# EAGLE design participante (EAGLE 7.3.0)

## Sheet 1 of 3
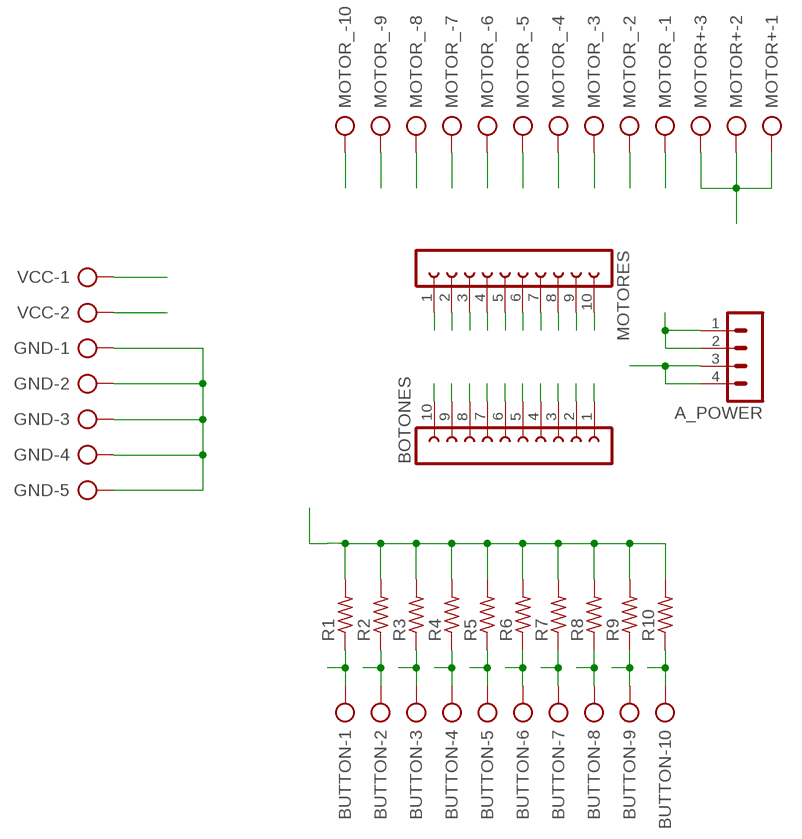
[diagram p0: schematic, sheet 1]

### Parts
A_POWER  MA04-1  [MA04-1]
BOTONES  FE10-1  [FE10]
BUTTON  AK300/10  [AK300/10]
GND  AK300/5  [AK300/5]
MOTOR+  AK300/3  [AK300/3]
MOTOR_  AK300/10  [AK300/10]
MOTORES  FE10-1  [FE10]
R1  R-US_0204/7  [0204/7]
R2  R-US_0204/7  [0204/7]
R3  R-US_0204/7  [0204/7]
R4  R-US_0204/7  [0204/7]
R5  R-US_0204/7  [0204/7]
R6  R-US_0204/7  [0204/7]
R7  R-US_0204/7  [0204/7]
R8  R-US_0204/7  [0204/7]
R9  R-US_0204/7  [0204/7]
R10  R-US_0204/7  [0204/7]
VCC  AK300/2  [AK300/2]

### Nets
5VDC: R1.2 R2.2 R3.2 R4.2 R5.2 R6.2 R7.2 R8.2 R9.2 R10.2 ; also sheet 3
A22: BOTONES.1 BUTTON.1 R1.1
A23: BOTONES.2 BUTTON.2 R2.1
A24: BOTONES.3 BUTTON.3 R3.1
A25: BOTONES.4 BUTTON.4 R4.1
A26: BOTONES.5 BUTTON.5 R5.1
A27: BOTONES.6 BUTTON.6 R6.1
A28: BOTONES.7 BUTTON.7 R7.1
A29: BOTONES.8 BUTTON.8 R8.1
A30: BOTONES.9 BUTTON.9 R9.1
A31: BOTONES.10 BUTTON.10 R10.1
AM_1: MOTORES.1 ; also sheet 2
AM_2: MOTORES.2 ; also sheet 2
AM_3: MOTORES.3 ; also sheet 2
AM_4: MOTORES.4 ; also sheet 2
AM_5: MOTORES.5 ; also sheet 2
AM_6: MOTORES.6 ; also sheet 2
AM_7: MOTORES.7 ; also sheet 2
AM_8: MOTORES.8 ; also sheet 2
AM_9: MOTORES.9 ; also sheet 2
AM_10: MOTORES.10 ; also sheet 2
GND: A_POWER.1 A_POWER.2 GND.1 GND.2 GND.3 GND.4 GND.5 ; also sheet 2,3
M_N1: MOTOR_.1 ; also sheet 2
M_N2: MOTOR_.2 ; also sheet 2
M_N3: MOTOR_.3 ; also sheet 2
M_N4: MOTOR_.4 ; also sheet 2
M_N5: MOTOR_.5 ; also sheet 2
M_N6: MOTOR_.6 ; also sheet 2
M_N7: MOTOR_.7 ; also sheet 2
M_N8: MOTOR_.8 ; also sheet 2
M_N9: MOTOR_.9 ; also sheet 2
M_N10: MOTOR_.10 ; also sheet 2
VCC: MOTOR+.1 MOTOR+.2 MOTOR+.3 VCC.2 ; also sheet 3
VCC_A: A_POWER.3 A_POWER.4 VCC.1

## Sheet 2 of 3
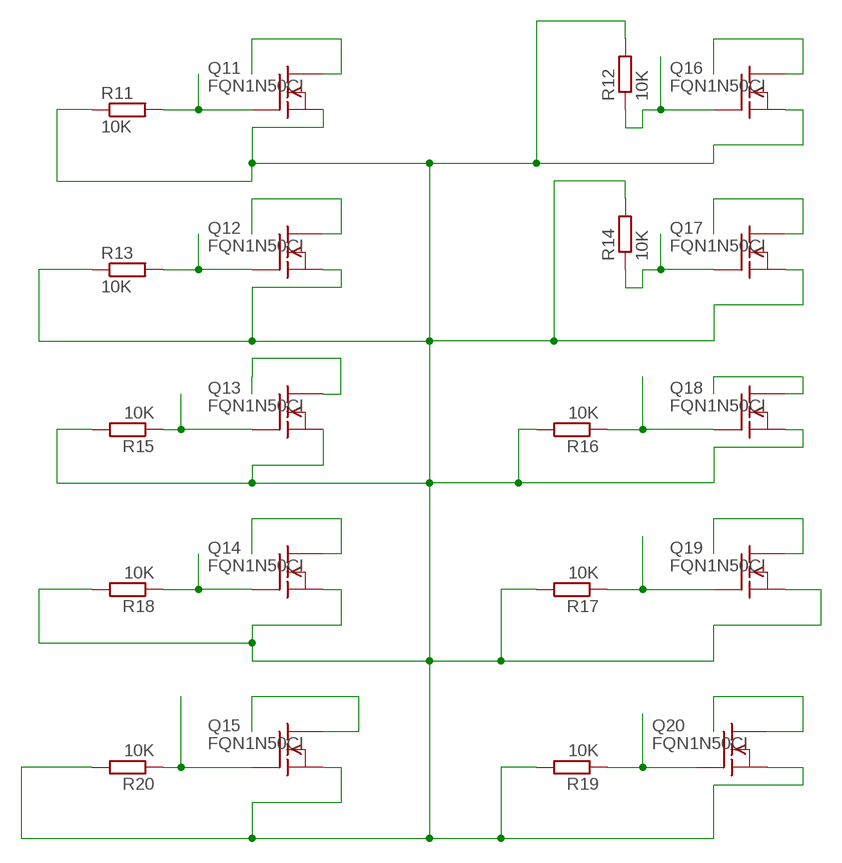
[diagram p1: schematic, sheet 2]

### Parts
Q11  FQN1N50CI  [TO92-INLINE]
Q12  FQN1N50CI  [TO92-INLINE]
Q13  FQN1N50CI  [TO92-INLINE]
Q14  FQN1N50CI  [TO92-INLINE]
Q15  FQN1N50CI  [TO92-INLINE]
Q16  FQN1N50CI  [TO92-INLINE]
Q17  FQN1N50CI  [TO92-INLINE]
Q18  FQN1N50CI  [TO92-INLINE]
Q19  FQN1N50CI  [TO92-INLINE]
Q20  FQN1N50CI  [TO92-INLINE]
R11  10K  R-EU_0207/10  [0207/10]
R12  10K  R-EU_0207/10  [0207/10]
R13  10K  R-EU_0207/10  [0207/10]
R14  10K  R-EU_0207/10  [0207/10]
R15  10K  R-EU_0207/10  [0207/10]
R16  10K  R-EU_0207/10  [0207/10]
R17  10K  R-EU_0207/10  [0207/10]
R18  10K  R-EU_0207/10  [0207/10]
R19  10K  R-EU_0207/10  [0207/10]
R20  10K  R-EU_0207/10  [0207/10]

### Nets
AM_1: Q11.2(G) R11.2 ; also sheet 1
AM_2: Q12.2(G) R13.2 ; also sheet 1
AM_3: Q13.2(G) R15.1 ; also sheet 1
AM_4: Q14.2(G) R18.1 ; also sheet 1
AM_5: Q15.2(G) R20.1 ; also sheet 1
AM_6: Q20.2(G) R19.1 ; also sheet 1
AM_7: Q19.2(G) R17.1 ; also sheet 1
AM_8: Q18.2(G) R16.1 ; also sheet 1
AM_9: Q17.2(G) R14.1 ; also sheet 1
AM_10: Q16.2(G) R12.1 ; also sheet 1
GND: Q11.3(S) Q12.3(S) Q13.3(S) Q14.3(S) Q15.3(S) Q16.3(S) Q17.3(S) Q18.3(S) Q19.3(S) Q20.3(S) R11.1 R12.2 R13.1 R14.2 R15.2 R16.2 R17.2 R18.2 R19.2 R20.2 ; also sheet 1,3
M_N1: Q11.1(D) ; also sheet 1
M_N2: Q12.1(D) ; also sheet 1
M_N3: Q13.1(D) ; also sheet 1
M_N4: Q14.1(D) ; also sheet 1
M_N5: Q15.1(D) ; also sheet 1
M_N6: Q16.1(D) ; also sheet 1
M_N7: Q17.1(D) ; also sheet 1
M_N8: Q18.1(D) ; also sheet 1
M_N9: Q19.1(D) ; also sheet 1
M_N10: Q20.1(D) ; also sheet 1

## Sheet 3 of 3
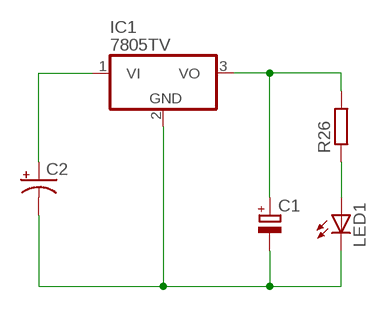
[diagram p2: schematic, sheet 3]

### Parts
C1  CPOL-EUE2.5-6  [E2,5-6]
C2  CPOL-USE3.5-8  [E3,5-8]
IC1  7805TV  [TO220V]
LED1  LED5MM  [LED5MM]
R26  R-EU_0207/10  [0207/10]

### Nets
5VDC: C1.+ IC1.3(VO) R26.2 ; also sheet 1
GND: C1.- C2.- IC1.2(GND) LED1.K(C) ; also sheet 1,2
N$192: LED1.A R26.1
VCC: C2.+ IC1.1(VI) ; also sheet 1

## Library data of the parts
A_POWER = con-lstb:MA04-1: PIN HEADER; OC_FARNELL: unknown; OC_NEWARK: unknown
BOTONES MOTORES = con-lsta:FE10-1: FEMALE HEADER; OC_FARNELL: unknown; OC_NEWARK: unknown
BUTTON MOTOR_ = con-ptr500:AK300/10: CONNECTOR; OC_FARNELL: unknown; OC_NEWARK: unknown
C1 = resistor:CPOL-EU: POLARIZED CAPACITOR, European symbol
C2 = adafruit:CPOL-US: POLARIZED CAPACITOR, American symbol
GND = con-ptr500:AK300/5: CONNECTOR; OC_FARNELL: unknown; OC_NEWARK: unknown
IC1 = linear:78*: Positive VOLTAGE REGULATOR Source: http://cache.national.com/ds/LM/LM78L05.pdf http://www.fairchildsemi.com/ds/LM/LM7805.pdf
LED1 = adafruit:LED: LED OSRAM: - CHIPLED LG R971, LG N971, LY N971, LG Q971, LY Q971, LO R971, LY R971 LH N974, LH R974 LS Q976, LO Q976, LY Q976 LO Q996 - Hyper CHIPLED LW Q18S LB Q993, LB Q99A, LB R99A - SideLED LS A670, LO A670, LY A670, LG A670, LP A670 LB A673, LV A673, LT A673, LW A673 LH A674 LY A675 LS A676, LA A676, LO A676, LY A676, LW A676 LS A679, LY A679, LG A679 - Hyper Micro SIDELED® LS Y876, LA Y876, LO Y876, LY Y876 LT Y87S - SmartLED LW L88C, LW L88S LB L89C, LB L89S, LG L890 LS L89K, LO L89K, LY L89K LS L896, LA L896, LO L896, LY L896 - TOPLED LS T670, LO T670, LY T670, LG T670, LP T670 LSG T670, LSP T670, LSY T670, LOP T670, LYG T670 LG T671, LOG T671, LSG T671 LB T673, LV T673, LT T673, LW T673 LH T674 LS T676, LA T676, LO T676, LY T676, LB T676, LH T676, LSB T676, LW T676 LB T67C, LV T67C, LT T67C, LS T67K, LO T67K, LY T67K, LW E67C LS E67B, LA E67B, LO E67B, LY E67B, LB E67C, LV E67C, LT E67C LW T67C LS T679, LY T679, LG T679 LS T770, LO T770, LY T770, LG T770, LP T770 LB T773, LV T773, LT T773, LW T773 LH T774 LS E675, LA E675, LY E675, LS T675 LS T776, LA T776, LO T776, LY T776, LB T776 LHGB T686 LT T68C, LB T68C - Hyper Mini TOPLED® LB M676 - Mini TOPLED Santana® LG M470 LS M47K, LO M47K, LY M47K Source: http://www.osram.convergy.de/
MOTOR+ = con-ptr500:AK300/3: CONNECTOR; OC_FARNELL: unknown; OC_NEWARK: unknown
Q11-Q20 = adafruit:FQN1N50C: N-Channel Enhancement MOSFET 500V, 0.4A, 6.0 Ohm
R1-R10 = rcl:R-US_: RESISTOR, American symbol
R11-R20 R26 = rcl:R-EU_: RESISTOR, European symbol
VCC = con-ptr500:AK300/2: CONNECTOR; OC_FARNELL: unknown; OC_NEWARK: unknown

## Net classes
0 default: clearance 0.205 mm

## Board
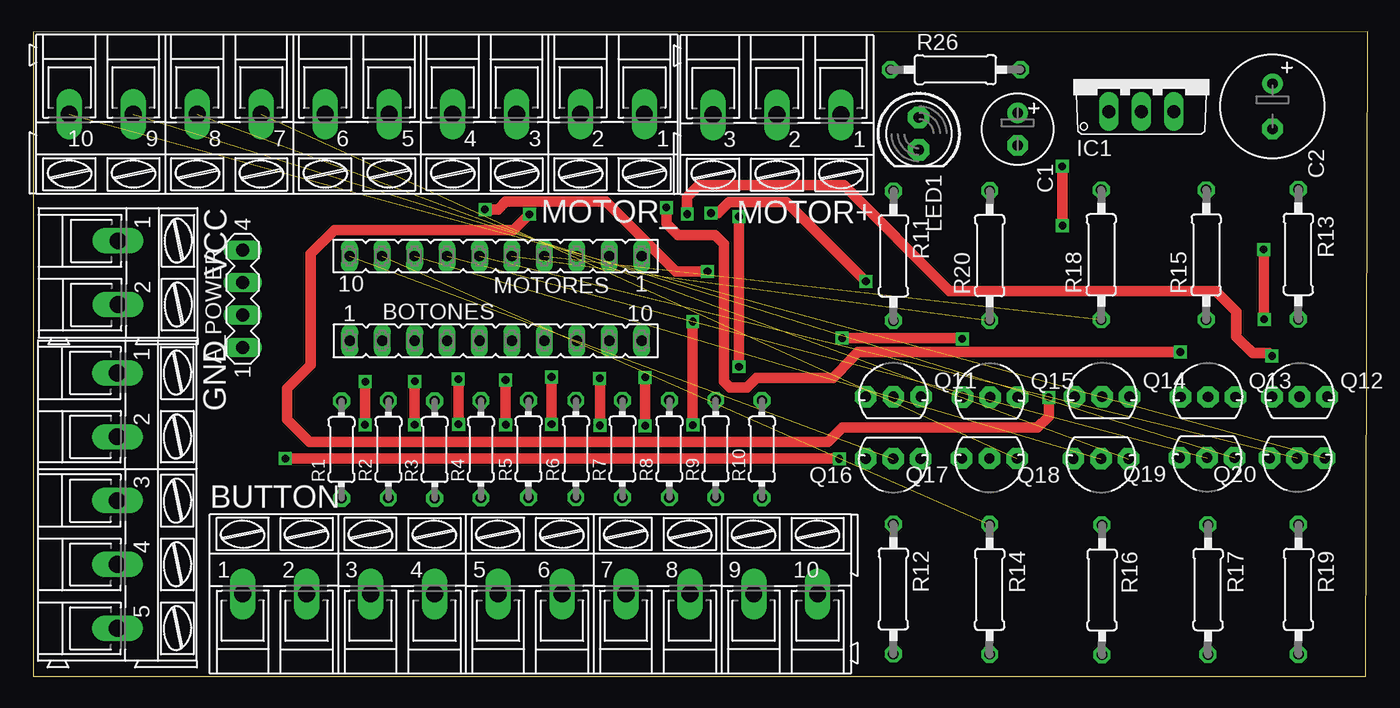
[diagram p3: board, top side]
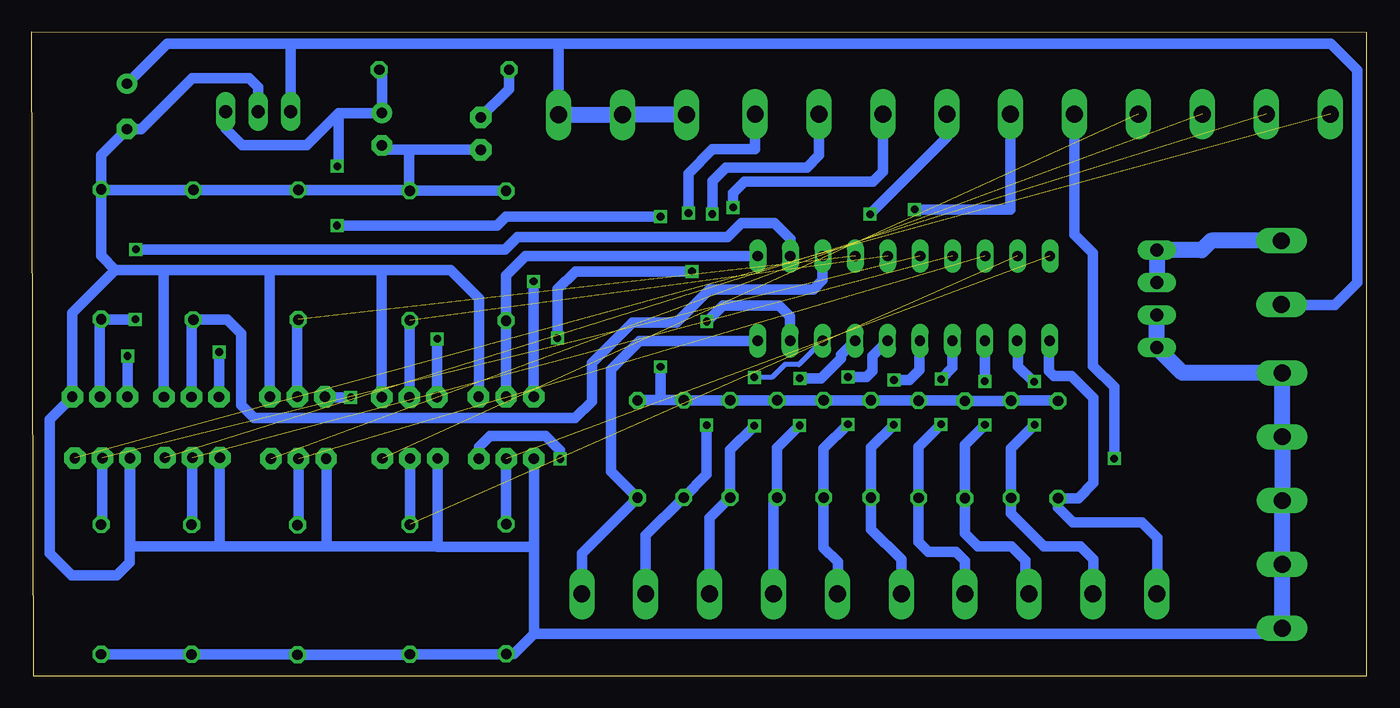
[diagram p4: board, bottom side, seen from below]

Size 104.48 x 50.44 mm. Coordinates in mm from the lower left corner, seen from the top.
Outline: 0,0 104.34,0 104.48,50.44 0,50.4 0,0
Copper layers (1*16): Top 0.035mm / dielectric 1.5mm / Bottom 0.035mm
Design rules "default": minimum track width 10mil, minimum drill 24mil, track to track 8mil, track to pad 8mil, pad to pad 8mil, via to via 8mil, smd to smd 8mil, copper to edge 40mil, drill to drill 8mil, minimum pad ring 10mil, minimum via ring 8mil, stop-mask expansion 4mil, vias tented up to drill 0mil, thermal gap 10mil

### Footprints (pad centres in the part's own frame; a part is rotated, then mirrored left to right if it is on the bottom)
MA04-1 = drill 1.016 long: 1 -3.81,0; 2 -1.27,0; 3 1.27,0; 4 3.81,0
FE10 = drill 0.813 long: 1 -11.43,0; 2 -8.89,0; 3 -6.35,0; 4 -3.81,0; 5 -1.27,0; 6 1.27,0; 7 3.81,0; 8 6.35,0; 9 8.89,0; 10 11.43,0
AK300/10 = drill 1.321 long: 1 -22.504,0; 2 -17.501,0; 3 -12.497,0; 4 -7.493,0; 5 -2.515,0; 6 2.489,0; 7 7.493,0; 8 12.497,0; 9 17.501,0; 10 22.504,0
E2,5-6 = drill 0.813 pad 1.6: + -1.27,0 | drill 0.813 pad 1.6 octagon: - 1.27,0
E3,5-8 = drill 0.813 pad 1.6: + -1.778,0 | drill 0.813 pad 1.6 octagon: - 1.778,0
AK300/5 = drill 1.321 long: 1 -10.008,0; 2 -5.004,0; 3 0,0; 4 5.004,0; 5 10.008,0
TO220V = drill 1.016 long: 1 -2.54,-2.54; 2 0,-2.54; 3 2.54,-2.54
LED5MM = drill 0.813 pad 1.676 octagon: A -1.27,0; K 1.27,0
AK300/3 = drill 1.321 long: 1 -5.004,0; 2 0,0; 3 5.004,0
TO92-INLINE = drill 0.813 pad 1.676 octagon: 1 -2.159,0; 2 0,0; 3 2.159,0
0204/7 = drill 0.813 octagon: 1 -3.81,0; 2 3.81,0
0207/10 = drill 0.813 octagon: 1 -5.08,0; 2 5.08,0
AK300/2 = drill 1.321 long: 1 -2.515,0; 2 2.489,0

### Placement (x,y rotation side)
A_POWER  16.41,29.55 90 top
BOTONES  36.23,26.25 0 top
BUTTON  38.93,6.42 0 top
C1  77.08,42.82 270 top
C2  97.03,44.61 270 top
GND  6.6,13.74 270 top
IC1  86.77,46.76 0 top
LED1  69.35,42.49 270 top
MOTOR+  58.25,43.95 180 top
MOTOR_  25.36,44 180 top
MOTORES  36.22,32.89 180 top
Q11  67.36,21.87 0 top
Q12  99.16,21.87 0 top
Q13  91.99,21.86 0 top
Q14  83.7,21.87 0 top
Q15  74.93,21.84 0 top
Q16  67.35,17.01 180 top
Q17  74.88,17.04 180 top
Q18  83.61,17.02 180 top
Q19  91.92,17.1 180 top
Q20  98.97,17.08 180 top
R1  24.15,17.73 90 top
R2  27.82,17.76 90 top
R3  31.44,17.73 90 top
R4  35.06,17.76 90 top
R5  38.79,17.79 90 top
R6  42.5,17.79 90 top
R7  46.14,17.79 90 top
R8  49.82,17.79 90 top
R9  53.45,17.79 90 top
R10  57.07,17.77 90 top
R11  67.36,32.91 270 top
R12  67.35,6.82 270 top
R13  99.06,33.03 270 top
R14  74.89,6.78 270 top
R15  91.85,32.98 90 top
R16  83.69,6.74 270 top
R17  91.99,6.78 270 top
R18  83.63,32.99 90 top
R19  99.07,6.78 270 top
R20  74.9,32.93 90 top
R26  72.21,47.49 0 top
VCC  6.66,31.57 270 top

### Tracks (layer width: path | path; a pad name or v marks a point on that pad's centre or on a via)
5VDC  (via drill 0.6 pad 1.02)
  Top 0.813: v80.57,39.92 80.57,35.3 v80.6,35.27 | v55.27,35.98 v55.27,24.22
  Bottom 0.813: R1.2 24.18,21.57 R2.2 27.85,21.54 R3.2 31.47,21.57 R4.2 35.09,21.6 R5.2 R6.2 R7.2 R8.2 R9.2 55.38,21.61 | R10.2 57.05,21.61 55.38,21.61 | R26.2 77.08,47.28 C1.+ | C1.+ 80.49,44.09 82.99,41.59 88.04,41.59 89.31,42.86 IC1.3 | C1.+ 80.48,44.09 80.48,40.01 v80.57,39.92 | v80.6,35.27 68.07,35.27 67.37,35.98 v55.28,35.98 v55.27,35.98 | v55.27,24.22 55.27,21.71 55.38,21.61
A22
  Bottom 0.813: BUTTON.1 16.39,6.46 16.39,10.81 17.6,12.03 22.98,12.03 24.15,13.2 R1.1 22.57,13.92 21.37,15.12 21.37,21.77 23.11,23.52 24.49,23.52 24.86,23.88 24.86,26.2 BOTONES.1
A23  (via drill 0.6 pad 1.02)
  Top 0.813: v26.01,23.06 25.98,23.03 v25.98,19.68
  Bottom 0.813: BUTTON.2 21.4,6.46 21.4,9.15 22.41,10.16 25.25,10.16 27.82,12.73 R2.1 27.82,17.84 v25.98,19.68 | BOTONES.2 27.28,26.2 27.28,24.24 26.1,23.06 v26.01,23.06
A24  (via drill 0.6 pad 1.02)
  Top 0.813: v29.89,23.08 29.88,23.07 v29.88,19.68
  Bottom 0.813: BUTTON.3 26.69,6.68 26.69,9.06 27.79,10.16 30.43,10.16 31.44,11.17 R3.1 31.44,18.11 v29.88,19.68 | BOTONES.3 29.89,26.24 v29.89,23.08
A25  (via drill 0.6 pad 1.02)
  Top 0.813: v33.3,23.25 33.31,23.24 v33.31,19.71
  Bottom 0.813: BUTTON.4 31.45,6.44 31.45,9.04 32.15,9.74 34.29,9.74 35.06,10.51 R4.1 35.06,17.96 v33.31,19.71 | BOTONES.4 32.42,24.16 33.3,23.28 v33.3,23.25
A26  (via drill 0.6 pad 1.02)
  Top 0.813: v37,23.18 37.01,23.16 v37.01,19.68
  Bottom 0.813: BUTTON.5 36.43,6.44 36.43,9.12 38.79,11.49 R5.1 38.79,17.9 v37.01,19.68 | BOTONES.5 34.99,26.22 34.99,23.96 35.77,23.18 v37,23.18
A27  (via drill 0.6 pad 1.02)
  Top 0.813: v40.6,23.42 v40.6,19.71
  Bottom 0.813: BUTTON.6 41.38,6.46 41.38,8.92 42.5,10.04 R6.1 42.5,17.82 v40.6,19.71 | BOTONES.6 38.68,25.07 38.68,23.9 39.16,23.42 v40.6,23.42
A28  (via drill 0.6 pad 1.02)
  Top 0.813: v44.36,23.31 44.38,23.3 v44.38,19.63
  Bottom 0.813: BUTTON.7 46.42,13.7 R7.1 46.15,17.86 v44.38,19.63 | BOTONES.7 41.14,25.15 41.14,24.88 42.71,23.31 v44.36,23.31
A29  (via drill 0.6 pad 1.02)
  Top 0.813: v47.93,23.39 v47.93,19.6
  Bottom 0.406: BOTONES.8 44.44,24.39 45.58,24.39 45.58,24.38 45.58,24.37 46.56,23.39 v47.93,23.39 | v47.93,23.39
  Bottom 0.813: BUTTON.8 51.42,12.38 R8.1 49.82,17.71 v47.93,19.6
A30  (via drill 0.6 pad 1.02)
  Top 0.813: v51.66,19.65 v51.65,19.66 v51.65,27.76
  Bottom 0.813: BUTTON.9 56.43,11 R9.1 51.66,15.77 v51.66,19.65 | v51.65,27.76 50.38,29.03 46,29.03 45.12,28.15 BOTONES.9
A31
  Bottom 0.813: BUTTON.10 61.43,9.6 R10.1 59.14,16.04 59.14,24.02 56.91,26.25 BOTONES.10
AM_1
  Bottom 0.813: Q11.2 R11.2 67.36,31.38 65.85,32.89 MOTORES.1
AM_2  (via drill 0.6 pad 1.02)
  Top 0.813: v96.35,33.41 96.35,27.98 v96.39,27.94
  Bottom 0.813: Q12.2 99.16,27.84 R13.2 99.05,27.94 v96.39,27.94 | MOTORES.2 45.11,34.23 46.35,35.48 48.95,35.48 50.04,34.38 66.46,34.38 67.44,33.41 v96.35,33.41
AM_3
  Bottom 0.813: Q13.2 91.99,27.76 R15.1 89.18,27.9 88.09,26.81 88.09,21.22 87.06,20.19 61.95,20.19 60.64,21.51 60.64,24.52 57.48,27.69 54.02,27.69 51.44,30.27 43.31,30.27 42.58,31 42.58,32.87 MOTORES.3
AM_4  (1 unrouted)
  Bottom 0.813: R18.1 83.7,27.84 Q14.2
AM_5  (1 unrouted)
  Bottom 0.813: R20.1 74.93,27.82 Q15.2
AM_6  (1 unrouted)
  Bottom 0.813: R19.1 98.97,11.96 Q20.2
AM_7  (1 unrouted)
  Bottom 0.813: R17.1 91.92,11.93 Q19.2
AM_8  (1 unrouted)
  Bottom 0.813: R16.1 83.61,11.91 Q18.2
AM_9  (1 unrouted)
  Bottom 0.813: R14.1 74.88,11.88 Q17.2
AM_10  (1 unrouted)
  Bottom 0.813: R12.1 Q16.2
GND
  Bottom 0.813: R19.2 R17.2 83.72,1.7 R16.2 74.93,1.66 R14.2 67.39,1.7 R12.2 66.75,1.74 65.17,3.33 65.17,3.35 | 72.61,16.93 Q17.3 72.73,10.15 | Q11.3 69.49,21.9 69.49,29.58 71.72,31.81 77.1,31.81 | 77.1,31.81 85.89,31.81 | 85.89,31.81 94.33,31.81 | 94.33,31.81 97.94,31.81 | 97.94,31.81 101.32,28.43 Q12.3 103.08,20.11 103.08,9.6 101.36,7.87 97.85,7.87 96.81,8.91 Q20.3 96.79,17.05 96.79,10.13 96.78,10.15 89.78,10.15 | Q16.3 65.17,16.99 65.17,10.13 | 72.73,10.15 72.71,10.13 65.17,10.13 | 89.78,10.15 81.42,10.15 | 81.42,10.15 72.73,10.15 | Q19.3 89.78,17.08 89.78,10.15 | Q18.3 81.42,16.99 81.42,10.15 | R11.1 67.38,38.01 R20.2 74.96,38.07 | 74.96,38.07 R18.2 R15.2 99.01,38.06 R13.1 | 97.94,31.81 99.06,32.93 R13.1 | R13.1 99.06,40.8 C2.- 95.91,42.83 91.94,46.8 87.47,46.8 86.78,46.12 86.78,44.23 IC1.2 | C1.- 76.74,41.22 74.99,41.22 | 74.99,41.22 LED1.K | 74.96,38.07 74.96,41.18 74.99,41.22 | Q15.3 77.09,31.8 77.1,31.81 | Q14.3 85.86,31.79 85.89,31.81 | Q13.3 94.15,31.63 94.33,31.81 | 65.17,10.13 65.17,3.35 | 65.17,3.35 65.14,3.32 7.01,3.32 GND.5
  Bottom 1.27: GND.5 GND.4 GND.3 GND.2 GND.1 14.42,23.75 A_POWER.1 A_POWER.2
M_N1  (via drill 0.6 pad 1.02)
  Top 0.813: v53.08,36.25 53.62,36.25 54.5,37.13 58.99,37.13 v65.21,30.91
  Bottom 0.813: MOTOR_.1 47.86,41.27 47.88,41.25 51.19,41.25 53.08,39.36 v53.08,36.25 | v65.21,30.91 Q11.1
M_N2  (via drill 0.6 pad 1.02)
  Top 0.813: v51.22,36.18 51.22,37.5 52.16,38.43 63.47,38.43 71.73,30.17 92.61,30.17 94.22,28.56 94.22,26.57 95.48,25.3 96.75,25.3 v96.99,25.06
  Bottom 0.813: MOTOR_.2 42.86,40.8 43.82,39.83 50.14,39.83 51.22,38.75 v51.22,36.18 | v96.99,25.06 96.99,21.88 Q12.1
M_N3  (via drill 0.6 pad 1.02)
  Top 0.813: v49.59,36.69 49.59,35.43 50.48,34.54 53.38,34.54 54.08,33.84 54.08,23.09 54.56,22.61 55.9,22.61 56.65,23.36 62.61,23.36 64.15,24.9 64.15,24.94 64.6,25.38 v89.82,25.38
  Bottom 0.813: MOTOR_.3 37.85,39.5 38.65,38.7 48.71,38.7 49.59,37.82 v49.59,36.69 | v89.82,25.38 Q13.1
M_N4  (via drill 0.6 pad 1.02)
  Top 0.813: v79.52,21.83 79.52,20.35 78.64,19.46 63.37,19.46 62.24,18.34 21.66,18.34 19.91,20.1 19.91,22.53 21.75,24.38 21.75,33.09 23.6,34.94 37.64,34.94 v38.87,36.17
  Bottom 0.813: MOTOR_.4 32.85,42.19 38.25,36.79 38.25,36.78 v38.87,36.17 | v79.52,21.83 81.5,21.83 Q14.1
M_N5  (via drill 0.6 pad 1.02)
  Top 0.813: v35.38,36.54 36.41,36.54 37.01,37.14 44.87,37.14 50.35,31.66 52.78,31.66 v52.81,31.68 | v63.34,26.46 72.69,26.46 v72.75,26.41
  Bottom 0.813: MOTOR_.5 27.87,36.56 27.89,36.54 v35.38,36.54 | v52.81,31.68 61.92,31.68 63.31,30.29 63.31,26.49 v63.34,26.46 | v72.75,26.41 72.75,21.86 Q15.1
M_N6  (via drill 0.6 pad 1.02)
  Top 0.813: v19.76,17.03 63.11,17.03 v63.13,17.01
  Bottom 0.813: MOTOR_.6 22.87,34.59 21.41,33.14 21.41,24.28 19.76,22.63 v19.76,17.03 | v63.13,17.01 63.13,17.67 64.26,18.79 68.62,18.79 69.49,17.92 69.49,17.03 Q16.1
M_N7  (1 unrouted)
M_N8  (1 unrouted)
M_N9  (1 unrouted)
M_N10  (1 unrouted)
N$192
  Bottom 0.813: LED1.A 67.13,45.97 R26.1
VCC
  Bottom 0.813: 63.26,49.53 2.81,49.53 0.73,47.44 0.73,30.82 2.47,29.07 VCC.2 | 63.26,49.53 84.16,49.53 | 84.16,49.53 84.23,49.46 IC1.1 | C2.+ 93.89,49.53 84.16,49.53 | MOTOR+.1 63.25,49.52 63.26,49.53
  Bottom 1.27: MOTOR+.3 MOTOR+.2 MOTOR+.1
VCC_A
  Bottom 1.27: A_POWER.3 A_POWER.4 16.39,33.34 12.91,33.34 12.17,34.09 VCC.1